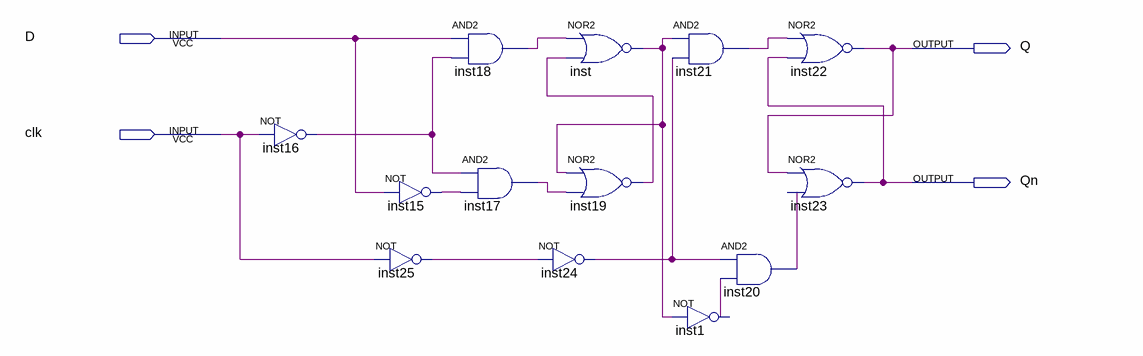
[diagram p0: schematic sheet]
// Quartus schematic ex7.bdf as structural Verilog: 13 symbols, 4 pins
module ex7 (
  input  D,
  input  clk,
  output Q,
  output Qn
);

  wire inst1_out, inst15_out, inst16_out, inst17_out, inst18_out, inst19_out, inst20_out, inst21_out,
       inst24_out, inst25_out, inst_out;

  not inst16 (inst16_out, clk);
  not inst15 (inst15_out, D);
  not inst25 (inst25_out, clk);
  and inst18 (inst18_out, D, inst16_out);
  and inst17 (inst17_out, inst16_out, inst15_out);
  nor inst (inst_out, inst18_out, inst19_out);
  nor inst19 (inst19_out, inst_out, inst17_out);
  not inst24 (inst24_out, inst25_out);
  and inst21 (inst21_out, inst_out, inst24_out);
  and inst20 (inst20_out, inst24_out, inst1_out);
  not inst1 (inst1_out, inst_out);
  nor inst22 (Q, inst21_out, Qn);
  nor inst23 (Qn, Q, inst20_out);
endmodule
